# EAGLE design untitled (EAGLE 9.6.0)
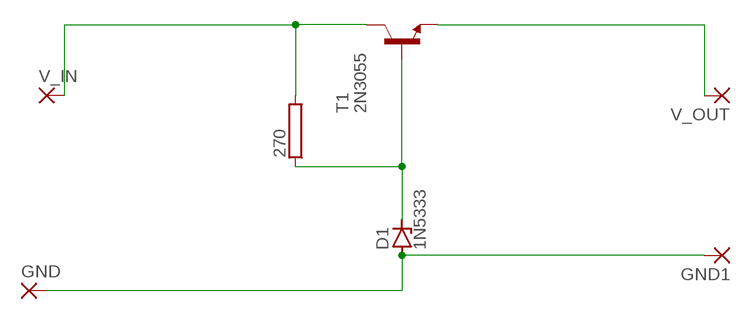
[diagram p0: schematic, sheet 1]

## Parts
270  RMG100-V  [TO-247-2V]
D1  1N5333  [C1702-15]
GND  3,17/1,1  [3,17/1,1]
GND1  3,17/1,1  [3,17/1,1]
T1  2N3055  [TO3]
V_IN  3,17/1,1  [3,17/1,1]
V_OUT  3,17/1,1  [3,17/1,1]

## Nets
N$1: 270.2 T1.C T1.C/(C) V_IN.1(P)
N$3: 270.1 D1.C T1.B
N$4: T1.E V_OUT.1(P)
N$5: D1.A GND1.1(P) GND.1(P)

## Library data of the parts
270 = resistor-power:RMG100: TO-247 Power Resistor - RMG 100 Series Source: www.token.com.tw .. power-resistor-rmg100pdf; OC_FARNELL: unknown; OC_NEWARK: unknown
D1 = diode:1N5333: Z DIODE 3.3 V, 5W, 5 percent (Motorola)
GND GND1 V_IN V_OUT = wirepad:3,17/1,1: THROUGH-HOLE PAD
T1 = transistor:2N3055: NPN TRANSISTOR

## Board
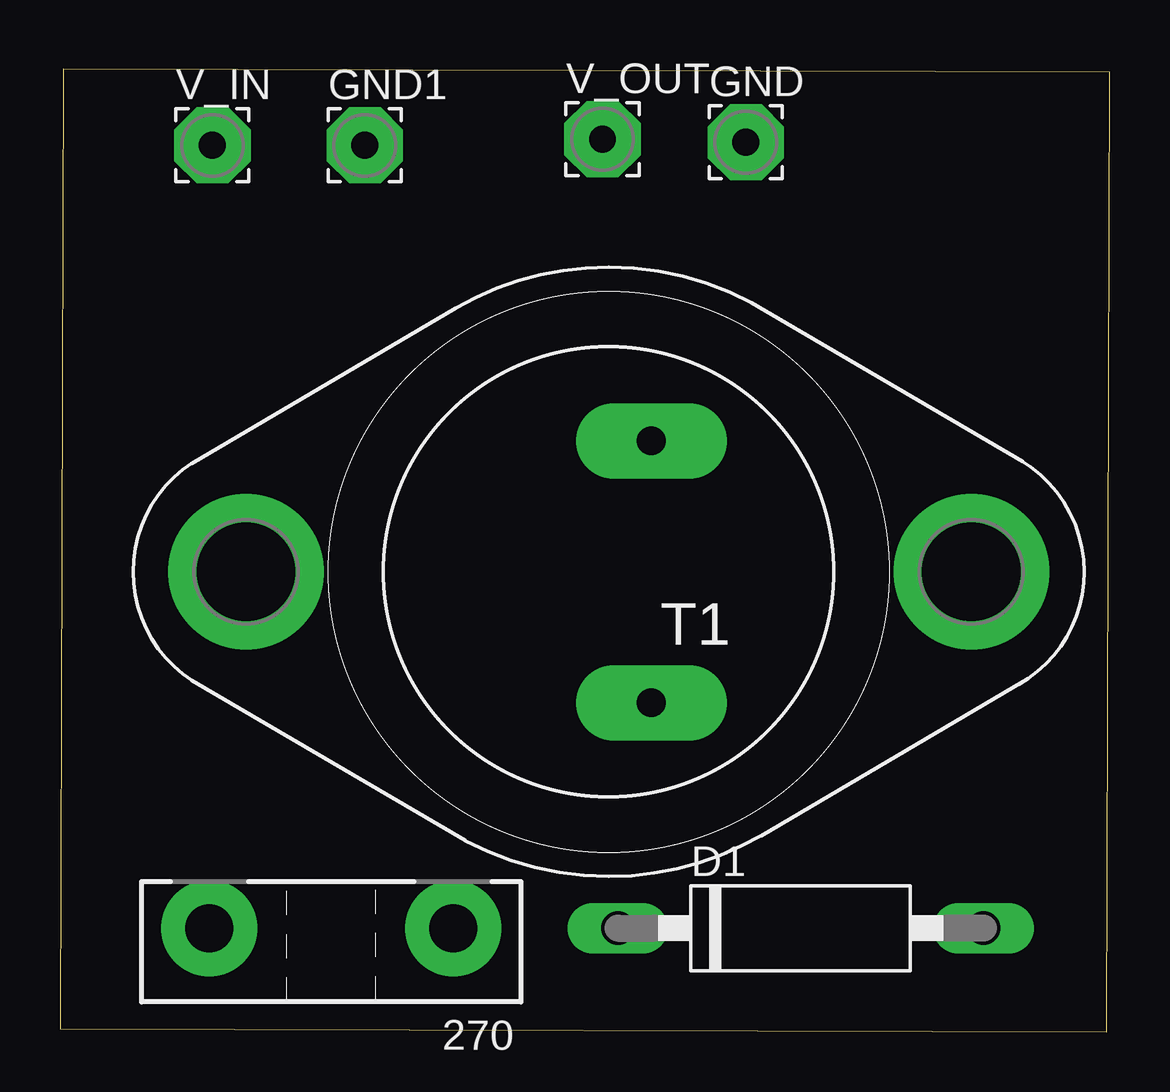
[diagram p1: board, top side]
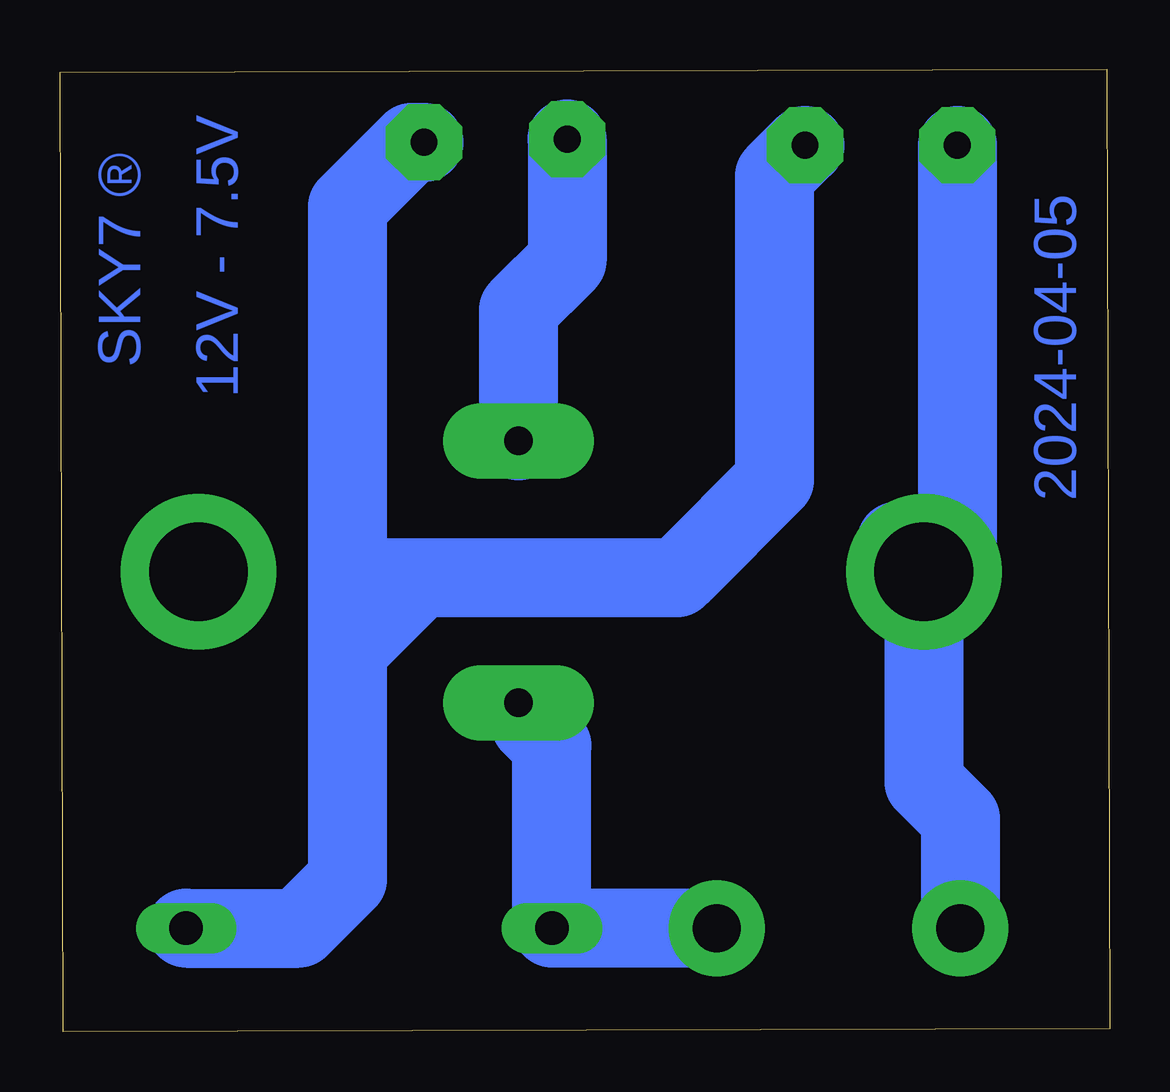
[diagram p2: board, bottom side, seen from below]

Size 43.74 x 40.12 mm. Coordinates in mm from the lower left corner, seen from the top.
Outline: 0,0.13 43.61,0 43.74,40 0.13,40.12 0,0.13
Copper layers (1*16): Top 0.035mm / dielectric 1.5mm / Bottom 0.035mm
Design rules "default": minimum track width 6mil, minimum drill 0.35mm, track to track 6mil, track to pad 6mil, pad to pad 6mil, via to via 6mil, smd to smd 6mil, copper to edge 40mil, drill to drill 6mil, minimum pad ring 10mil, minimum via ring 8mil, stop-mask expansion 4mil, vias tented up to drill 0mil, thermal gap 10mil

### Footprints (pad centres in the part's own frame; a part is rotated, then mirrored left to right if it is on the bottom)
TO-247-2V = drill 2 pad 4: 1 -5.08,0; 2 5.08,0
C1702-15 = drill 1.397 long: A 7.62,0; C -7.62,0
3,17/1,1 = drill 1.118 pad 3.175 octagon: 1 0,0
TO3 = drill 1.194 pad 3.15 long: B -1.778,5.461; E -1.778,-5.461 | drill 4.115 pad 6.477: C 15.113,0; C/ -15.113,0

### Placement (x,y rotation side)
270  11.3,4.32 180 top
D1  30.86,4.32 0 top
GND  28.57,37.08 0 top
GND1  12.7,36.96 0 top
T1  22.86,19.18 180 top
V_IN  6.35,36.96 0 top
V_OUT  22.61,37.21 0 top

### Tracks (layer width: path | path; a pad name or v marks a point on that pad's centre or on a via)
N$1
  Bottom 2.54: 6.35,20.57 T1.C | 270.2 6.22,4.06 6.35,3.94 6.35,9.02 7.75,10.41
  Bottom 3.302: V_IN.1 6.35,20.57 | T1.C 7.62,19.3 7.62,20.45 8.89,20.45 8.89,20.32 T1.C | T1.C 7.75,10.41 6.22,8.89 6.22,4.06
N$3
  Bottom 2.54: D1.C 23.24,8.89 23.37,9.02 23.37,12.45 T1.B
  Bottom 3.302: 270.1 D1.C 23.24,11.94 24.13,12.83
N$4
  Bottom 3.302: V_OUT.1 22.61,32.13 24.64,30.1 T1.E
N$5
  Bottom 2.54: 31.75,6.35 31.75,15.37 29.21,17.91 | 29.21,17.91 27.94,19.18 17.78,19.18 | GND.1 31.75,33.91 31.75,20.45 29.21,17.91
  Bottom 3.302: D1.A 33.78,4.32 31.75,6.35 31.75,34.42 29.08,37.08 GND.1 | GND1.1 13.97,35.69 13.97,22.99 17.78,19.18 18.03,18.92 30.99,18.92

### Text on the board
Bottom: 12V - 7.5V | SKY7 ® | 2024-04-05